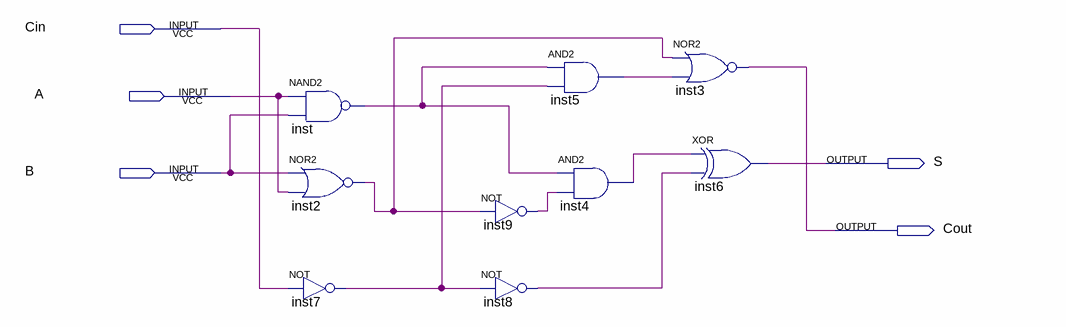
[diagram p0: schematic sheet]
// Quartus schematic SOMA1BIT.bdf as structural Verilog: 9 symbols, 5 pins
module SOMA1BIT (
  input  Cin,
  input  A,
  input  B,
  output S,
  output Cout
);

  wire inst2_out, inst4_out, inst5_out, inst7_out, inst8_out, inst9_out, inst_out;

  nand inst (inst_out, A, B);
  nor inst2 (inst2_out, B, A);
  not inst7 (inst7_out, Cin);
  not inst9 (inst9_out, inst2_out);
  not inst8 (inst8_out, inst7_out);
  and inst5 (inst5_out, inst_out, inst7_out);
  and inst4 (inst4_out, inst_out, inst9_out);
  nor inst3 (Cout, inst2_out, inst5_out);
  xor inst6 (S, inst4_out, inst8_out);
endmodule
